# EAGLE design Audio-Reg (EAGLE 9.6.2)
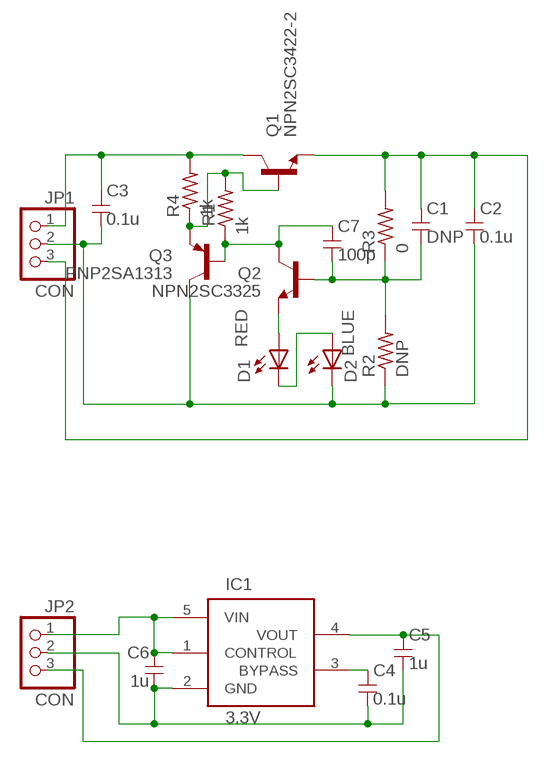
[diagram p0: schematic, sheet 1]

## Parts
C1  DNP  C-1608  [1608]
C2  0.1u  C-1608  [1608]
C3  0.1u  C-1608  [1608]
C4  0.1u  C-1608  [1608]
C5  1u  C-1608  [1608]
C6  1u  C-1608  [1608]
C7  100p  C-1608  [1608]
D1  RED  LED-SMD1608  [D1608]
D2  BLUE  LED-SMD1608  [D1608]
IC1  3.3V  NJM2863  [SOT23-5]
JP1  CON  PINHD-1X3  [1X03]
JP2  CON  PINHD-1X3  [1X03]
Q1  NPN2SC3422-2  [TO126-2]
Q2  NPN2SC3325  [SC59]
Q3  PNP2SA1313  [SC59]
R1  1k  R-1608  [1608]
R2  DNP  R-1608  [1608]
R3  0  R-1608  [1608]
R4  1k  R-1608  [1608]

## Nets
GND: C2.2 C3.2 D2.K JP1.2 Q3.3(C) R2.1
IN: C3.1 JP1.1 Q1.2(C) R4.2
N$1: Q1.3(B) Q3.2(E) R1.2 R4.1
N$2: D1.K D2.A
N$3: C1.2 C7.2 Q2.1(B) R2.2 R3.1
N$4: D1.A Q2.2(E)
N$6: C4.1 IC1.3(BYPASS)
N$7: C4.2 C5.2 C6.2 IC1.2(GND) JP2.2
N$8: C6.1 IC1.1(CONTROL) IC1.5(VIN) JP2.1
N$9: C5.1 IC1.4(VOUT) JP2.3
N$10: C7.1 Q2.3(C) Q3.1(B) R1.1
OUT: C1.1 C2.1 JP1.3 Q1.1(E) R3.2

## Library data of the parts
C1-C7 = my_rcl:C
D1 D2 = my_rcl:LED
IC1 = my_ic:NJM2863
JP1 JP2 = pinhead:PINHD-1X3: PIN HEADER
Q1 Q2 = my_ic:NPN
Q3 = my_ic:PNP
R1-R4 = my_rcl:R

## Board
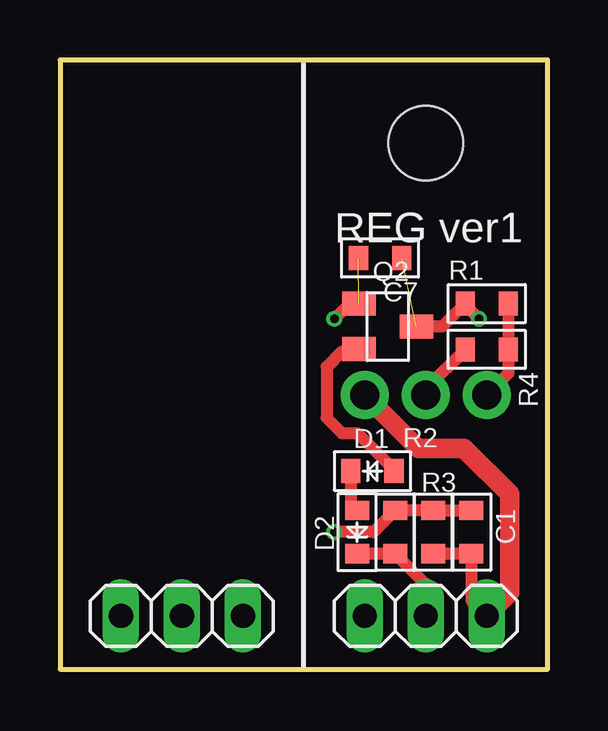
[diagram p1: board, top side]
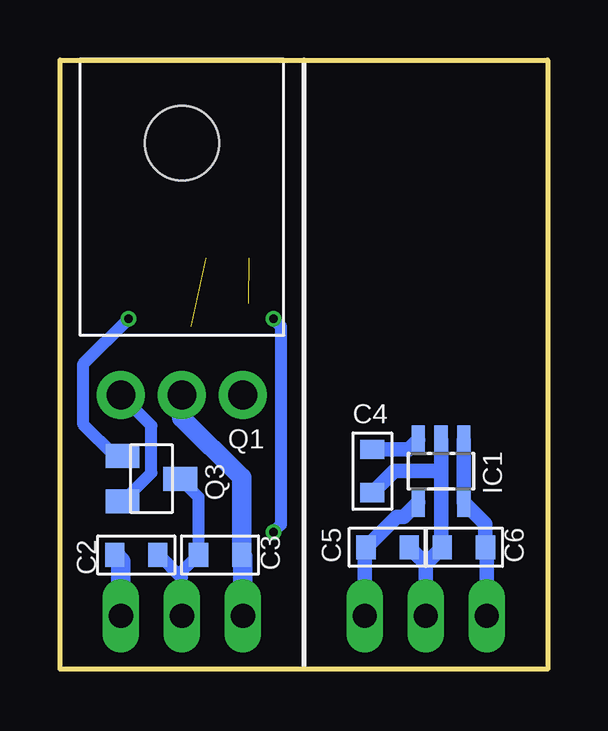
[diagram p2: board, bottom side, seen from below]

Size 20.32 x 25.4 mm. Coordinates in mm from the lower left corner, seen from the top.
Outline: 0,0 20.32,0 20.32,25.4 0,25.4 0,0
Copper layers (1*16): Top 0.035mm / dielectric 1.5mm / Bottom 0.035mm
Design rules "SeeedStudio_2layer_DRU_20140221": minimum track width 6mil, minimum drill 0.3mm, track to track 8mil, track to pad 8mil, pad to pad 8mil, via to via 12mil, smd to smd 0mil, copper to edge 0.3mm, drill to drill 10mil, minimum pad ring 0.15mm, minimum via ring 6mil, stop-mask expansion 2mil, vias tented up to drill 1mm, thermal gap 10mil

### Footprints (pad centres in the part's own frame; a part is rotated, then mirrored left to right if it is on the bottom)
1608 = smd 0.8 x 1: 1 -0.9,0; 2 0.9,0
D1608 = smd 0.8 x 1: A 0.9,0; K -0.9,0
SOT23-5 = smd 0.55 x 1.2: 1 -0.95,-1.3; 2 0,-1.3; 3 0.95,-1.3; 4 0.95,1.3; 5 -0.95,1.3
1X03 = drill 1.016 long: 1 -2.54,0; 2 0,0; 3 2.54,0
TO126-2 = drill 1.2 pad 2: 1 2.54,0; 2 0,0; 3 -2.54,0 | hole 3.1: 0,10.5
SC59 = smd 1 x 1.4: 1 -0.95,-1.2; 2 0.95,-1.2; 3 0,1.2

### Placement (x,y rotation side)
C1  17.14,5.71 90 top
C2  17.14,4.76 0 bottom
C3  13.65,4.76 180 bottom
C4  7.3,8.26 270 bottom
C5  6.67,5.08 0 bottom
C6  3.49,5.08 180 bottom
C7  13.34,17.14 180 top
D1  13.02,8.26 0 top
D2  12.38,5.71 90 top
IC1  4.45,8.26 180 bottom
JP1  15.24,2.22 0 top
JP2  5.08,2.22 0 top
Q1  15.24,11.43 0 bottom
Q2  13.65,14.29 270 top
Q3  16.51,7.94 270 bottom
R1  17.78,15.24 0 top
R2  13.97,5.71 90 top
R3  15.56,5.71 270 top
R4  17.78,13.34 180 top

### Tracks (layer width: path | path; a pad name or v marks a point on that pad's centre or on a via)
GND
  Top 0.508: JP1.2 15.24,3.54 R2.1 D2.K
  Bottom 0.508: JP1.2 15.24,3.81 | 15.24,3.81 15.24,4.08 C3.2 14.55,7.18 Q3.3 | 15.24,3.81 16.19,4.76 C2.2
IN
  Top 0.508: Q1.2 15.24,11.7 R4.2
  Bottom 0.813: JP1.1 12.7,4.71 C3.1 12.75,7.99 15.24,10.48 Q1.2
N$1
  Top 0.508: Q1.3 18.68,12.33 R4.1 R1.2
  Bottom 0.508: Q3.2 16.51,8.19 16.51,10.16 Q1.3
N$2
  Top 0.508: D1.K 12.12,6.88 D2.A
N$3  (via drill 0.35)  (1 unrouted)
  Top 0.508: C1.2 R3.1 R2.2 13.07,5.71 v11.43,5.71 | v11.43,14.61 12.06,15.24 Q2.1
  Bottom 0.508: v11.43,5.71 11.11,6.03 11.11,14.29 v11.43,14.61
N$4
  Top 0.508: D1.A 13.92,8.31 12.38,9.84 11.75,9.84 11.11,10.48 11.11,12.61 11.75,13.24 12.45,13.24 Q2.2
N$6
  Bottom 0.61: C4.1 5.79,9.15 IC1.3
N$7
  Bottom 0.61: JP2.2 5.08,4.39 | 5.08,4.39 C6.2 4.45,5.13 4.45,8.26 | 5.08,4.39 C5.2 | IC1.2 4.45,8.26 | C4.2 6.4,8.26 4.45,8.26
N$8
  Bottom 0.61: JP2.1 2.54,5.03 C6.1 2.59,6.05 IC1.5 IC1.1
N$9
  Bottom 0.61: JP2.3 7.62,5.03 C5.1 6.3,6.35 6,6.35 IC1.4
N$10  (via drill 0.35)  (1 unrouted)
  Top 0.508: Q2.3 15.93,14.29 R1.1 16.88,15.19 v17.46,14.61
  Bottom 0.508: Q3.1 18.03,8.89 19.37,10.23 19.37,12.7 v17.46,14.61
OUT
  Top 0.508: R3.2 C1.1 17.14,2.86 JP1.3
  Top 0.813: Q1.1 14.92,9.21 16.83,9.21 18.73,7.3 18.73,3.17 JP1.3
  Bottom 0.813: JP1.3 17.78,4.5 C2.1

### Text on the board
tPlace: REG ver1